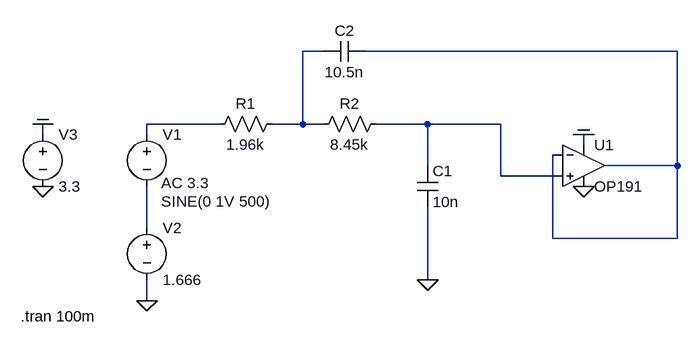
[diagram p0: schematic Draft2.asc]
Draft2.asc, the LTspice schematic file:
Version 4
SHEET 1 880 680
WIRE -256 -16 -288 -16
WIRE 288 -16 -192 -16
WIRE -416 96 -528 96
WIRE -288 96 -288 -16
WIRE -288 96 -336 96
WIRE -256 96 -288 96
WIRE -96 96 -176 96
WIRE 16 96 -96 96
WIRE -688 112 -688 96
WIRE -528 112 -528 96
WIRE 144 128 144 112
WIRE 112 144 96 144
WIRE -96 160 -96 96
WIRE 288 160 288 -16
WIRE 288 160 176 160
WIRE 16 176 16 96
WIRE 112 176 16 176
WIRE -528 256 -528 192
WIRE 96 272 96 144
WIRE 288 272 288 160
WIRE 288 272 96 272
WIRE -96 336 -96 224
WIRE -528 368 -528 336
FLAG -688 192 0
FLAG -528 368 0
FLAG 144 192 0
FLAG -688 96 COM
FLAG -96 336 0
FLAG 144 112 COM
SYMBOL OpAmps\\OP191 144 96 R0
SYMATTR InstName U1
SYMBOL voltage -528 96 R0
WINDOW 3 22 119 Left 2
WINDOW 123 22 91 Left 2
WINDOW 39 0 0 Left 0
SYMATTR InstName V1
SYMATTR Value SINE(0 1V 500)
SYMATTR Value2 AC 3.3
SYMBOL voltage -688 96 R0
WINDOW 123 0 0 Left 0
WINDOW 39 0 0 Left 0
SYMATTR InstName V3
SYMATTR Value 3.3
SYMBOL res -320 80 R90
WINDOW 0 0 56 VBottom 2
WINDOW 3 32 56 VTop 2
SYMATTR InstName R1
SYMATTR Value 1.96k
SYMBOL res -160 80 R90
WINDOW 0 0 56 VBottom 2
WINDOW 3 32 56 VTop 2
SYMATTR InstName R2
SYMATTR Value 8.45k
SYMBOL cap -112 160 R0
SYMATTR InstName C1
SYMATTR Value 10n
SYMBOL cap -192 -32 R90
WINDOW 0 0 32 VBottom 2
WINDOW 3 32 32 VTop 2
SYMATTR InstName C2
SYMATTR Value 10.5n
SYMBOL voltage -528 240 R0
WINDOW 123 0 0 Left 0
WINDOW 39 0 0 Left 0
SYMATTR InstName V2
SYMATTR Value 1.666
TEXT -722 392 Left 2 !.tran 100m

The netlist it stands for:
* Draft2.asc
XU1 N004 N002 COM 0 N002 OP191  ; pins In+ In- V+ V- OUT
V1 N003 N005 SINE(0 1V 500) AC 3.3
V3 COM 0 3.3
R1 N001 N003 1.96k
R2 N004 N001 8.45k
C1 N004 0 10n
C2 N002 N001 10.5n
V2 N005 0 1.666
.tran 100m
.lib ADI.lib
.backanno
.end